# Altium schematic sheet eos26_motherboard_heater_adapter_banana.SchDoc
size A
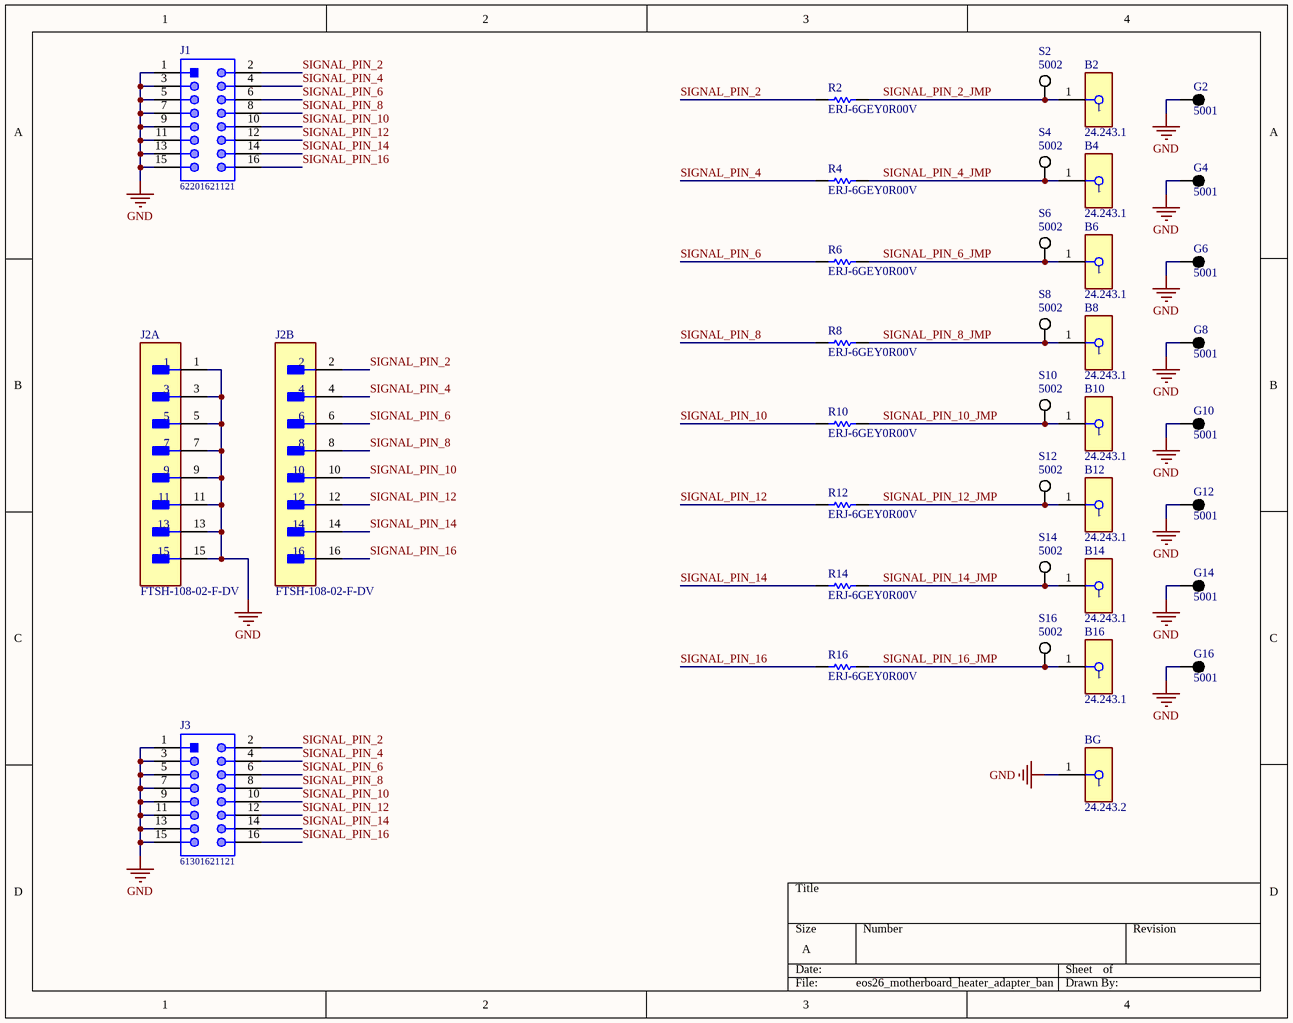
[diagram p0: eos26_motherboard_heater_adapter_banana.SchDoc]

## Parts
B2  24.243.1  [FP-24_243_1-MFG]
B4  24.243.1  [FP-24_243_1-MFG]
B6  24.243.1  [FP-24_243_1-MFG]
B8  24.243.1  [FP-24_243_1-MFG]
B10  24.243.1  [FP-24_243_1-MFG]
B12  24.243.1  [FP-24_243_1-MFG]
B14  24.243.1  [FP-24_243_1-MFG]
B16  24.243.1  [FP-24_243_1-MFG]
BG  24.243.2  [FP-24_243_2-MFG]
G2  5001  [KSTN-5001]
G4  5001  [KSTN-5001]
G6  5001  [KSTN-5001]
G8  5001  [KSTN-5001]
G10  5001  [KSTN-5001]
G12  5001  [KSTN-5001]
G14  5001  [KSTN-5001]
G16  5001  [KSTN-5001]
J1  62201621121  [62201621121]
J2  FTSH-108-02-F-DV  [LIBRARYSOURCE=Vault|VAULTGUID=B7D15EC3-160A-466F-A46C-7801FE6295A7|REVISIONGUID=4386816A-B426-492F-A73C-09950B70C106|FOOTPRINT=FP-FTSH-108-02-F-DV]  (parts A,B of 2)
J3  61301621121  [61301621121]
R2  ERJ-6GEY0R00V  [RESC2013X70X40NL20T20]
R4  ERJ-6GEY0R00V  [RESC2013X70X40NL20T20]
R6  ERJ-6GEY0R00V  [RESC2013X70X40NL20T20]
R8  ERJ-6GEY0R00V  [RESC2013X70X40NL20T20]
R10  ERJ-6GEY0R00V  [RESC2013X70X40NL20T20]
R12  ERJ-6GEY0R00V  [RESC2013X70X40NL20T20]
R14  ERJ-6GEY0R00V  [RESC2013X70X40NL20T20]
R16  ERJ-6GEY0R00V  [RESC2013X70X40NL20T20]
S2  5002  [KSTN-5002]
S4  5002  [KSTN-5002]
S6  5002  [KSTN-5002]
S8  5002  [KSTN-5002]
S10  5002  [KSTN-5002]
S12  5002  [KSTN-5002]
S14  5002  [KSTN-5002]
S16  5002  [KSTN-5002]

## Nets
GND: BG.1 G2.1 G4.1 G6.1 G8.1 G10.1 G12.1 G14.1 G16.1 J1.1 J1.3 J1.5 J1.7 J1.9 J1.11 J1.13 J1.15 J2.1 J2.3 J2.5 J2.7 J2.9 J2.11 J2.13 J2.15 J3.1 J3.3 J3.5 J3.7 J3.9 J3.11 J3.13 J3.15
SIGNAL_PIN_2: J1.2 J2.2 J3.2 R2.1
SIGNAL_PIN_2_JMP: B2.1 R2.2 S2.1
SIGNAL_PIN_4: J1.4 J2.4 J3.4 R4.1
SIGNAL_PIN_4_JMP: B4.1 R4.2 S4.1
SIGNAL_PIN_6: J1.6 J2.6 J3.6 R6.1
SIGNAL_PIN_6_JMP: B6.1 R6.2 S6.1
SIGNAL_PIN_8: J1.8 J2.8 J3.8 R8.1
SIGNAL_PIN_8_JMP: B8.1 R8.2 S8.1
SIGNAL_PIN_10: J1.10 J2.10 J3.10 R10.1
SIGNAL_PIN_10_JMP: B10.1 R10.2 S10.1
SIGNAL_PIN_12: J1.12 J2.12 J3.12 R12.1
SIGNAL_PIN_12_JMP: B12.1 R12.2 S12.1
SIGNAL_PIN_14: J1.14 J2.14 J3.14 R14.1
SIGNAL_PIN_14_JMP: B14.1 R14.2 S14.1
SIGNAL_PIN_16: J1.16 J2.16 J3.16 R16.1
SIGNAL_PIN_16_JMP: B16.1 R16.2 S16.1

## Library data of the parts
B2 B4 B6 B8 B10 B12 B14 B16 = CMP-12400-000001-1: RECEPTACLE, 20A, 4MM, PCB, SOLDER, RED; Manufacturer: Multicomp; Conn Orientation: Horizontal; Number Of Contacts: 1; Current Rating: 24A; Voltage Rating: 60V; Is Female: yes; ComponentLink2Description: Datasheet; Device Class L3: unset; Manufacturer Part Number: 24.243.1; RoHS: TRUE; Package: 24.243.1; ComponentLink2URL: https://datasheet.octopart.com/24.243.1-Multicomp-datasheet-38887736.pdf; Lead Free: Yes; Category: Conn; Height: 13mm; Device Class L2: unset; Device Class L1: Connectors; Contact Material: Silver; Automotive: No; Octopart: https://octopart.com/24.243.1-multicomp-57101049
BG = CMP-12400-000002-1: RECEPTACLE, 20A, 4MM, PCB, SOLDER, BLACK; Manufacturer: Multicomp; Is Female: yes; Current Rating: 24A; Number Of Contacts: 1; Conn Orientation: Horizontal; Voltage Rating: 60V; Device Class L3: unset; Category: Conn; Contact Material: Silver; Octopart: https://octopart.com/24.243.2-multicomp-57101050; ComponentLink2URL: https://datasheet.octopart.com/24.243.2-Multicomp-datasheet-38887736.pdf; ComponentLink2Description: Datasheet; Automotive: No; Package: 24.243.2; Height: 13mm; Device Class L2: unset; Device Class L1: Connectors; Lead Free: Yes; Manufacturer Part Number: 24.243.2; RoHS: TRUE
G2 G4 G6 G8 G10 G12 G14 G16 = CMP-2000-05181-1: Test Point, Black, 1-Pin THD, RoHS, Bulk; Manufacturer: Keystone; Other Names: 5001K; Catalog Drawings: 5000Series; Alternate Color: 5004K-ND / -TESTPOINTPCMINI.040"DYELLOW / 5003K-ND / -TESTPOINTPCMINI.040"DORANGE / 5002K-ND / -TESTPOINTPCMINI.040"DWHITE / 5000K-ND / -TESTPOINTPCMINI.040"DRED; Kits: DKTGRS232C-KIT-ND / -TTLCONVERTER; Online Catalog: ColorCodedTestPoints; Datasheet URL: https://ciiva.com/datasheet-click-2917627?src=ciiva&sig=bd195616; Mounting Type: 0.040"(1.02mm)HoleDiameter; Family: TestPoints; RoHS Information: RoHSComplianceStatement; Datasheet Version: Rev. G, 12/2008; Color: Black; Category: TestandMeasurement; Standard Package: 100; Manufacturer URL: http://www.keyelco.com/; Material: Base,Nylon46,UL94V-0; Type: PCTestPoint,Miniature; Terminal: 0.010"x0.020"(0.25mmx0.51mm)PhosphorBronzeWire,SilverPlated; Series: THM; Packaging: Bulk
J1 = CMP-1502-00950-1: THT Vertical Pin Header WR-PHD, Pitch 1.27 mm, Dual Row, 16 pins; Manufacturer: Wurth Elektronik; Gender: Male; Working Voltage: 100VAC; Rated Current: 1A; Pin Number: 16; Pitch: 1.27mm; Contact Resistance: 20mOhm; Withstanding Voltage: 500VAC; Publisher: WurthElektronik; Package Reference: 62201621121; Part Number: 62201621121; Packaging: Box; Row Number: Dual; Mounting Technology: THT; Operating Temperature: -40to105degC; Manufacturer URL: http://www.we-online.de; Orientation: Vertical; Datasheet URL: https://katalog.we-online.de/em/datasheet/62201621121.pdf
J2 = FP-FTSH-108-02-F-DV: CONN HEADER SMD 16POS 1.27MM; Manufacturer: Samtec; Standoff Height: 0.46mm; Conn Orientation: Vertical; Current Rating: 3.4A; Number Of Contacts: 16; Conn Gender: Male; Lead Free: Yes; Package: FTSH-108-02-F-DV; Footprint Url: http://suddendocs.samtec.com/prints/ftsh-1xx-xx-xxx-dv-xxx-footprint.pdf; Automotive: No; Pitch: 1.27mm; Manufacturer Part Number: FTSH-108-02-F-DV; Device Class L2: Headers and Wire Housings; ComponentLink2URL: http://suddendocs.samtec.com/prints/ftsh-1xx-xx-xxx-dv-xxx-xxx-mkt.pdf; ComponentLink2Description: Datasheet; Octopart: https://octopart.com/ftsh-108-02-f-dv-samtec-10605893; RoHS: TRUE; Digikey Description: CONN HEADER SMD 16POS 1.27MM; Device Class L1: Connectors; Temperature Range High: +125°C; Temperature: -55°C to +125°C; Device Class L3: unset; Category: Conn; Temperature Range Low: -55°C; Number Of Rows: 2; Contact Material: Gold,Nickel; Mouser Description: Conn Unshrouded Header HDR 16 POS 1.27mm Solder ST SMD Tube; Height: 5.09mm
J3 = CMP-1502-01097-1: THT Vertical Pin Header WR-PHD, Pitch 2.54 mm, Dual Row, 16 pins; Manufacturer: Wurth Elektronik; Gender: Male; Rated Current: 3A; Pitch: 2.54mm; Withstanding Voltage: 500VAC; Contact Resistance: 20mOhm; Working Voltage: 250VAC; Pin Number: 16; Mounting Technology: THT; Orientation: Vertical; Manufacturer URL: http://www.we-online.de; Row Number: Dual; Part Number: 61301621121; Datasheet URL: https://katalog.we-online.de/em/datasheet/6130xx21121.pdf; Packaging: Bag; Operating Temperature: -40to105degC; Publisher: WurthElektronik; Package Reference: 61301621121
R2 R4 R6 R8 R10 R12 R14 R16 = CMP-1665-00002-5: Chip Resistor, 0 Ohm, +/- 1%, 0.125 W, -55 to 155 degC, 0805 (2012 Metric), RoHS, Tape and Reel; Tolerance: 5%; Resistance: 0 Ohm; REACH SVHC: No SVHC; Min Operating Temperature: -55 degC; Case/Package: 0805; Packaging: Tape and Reel; Package Quantity: 5000; ComponentLink1Description: Manufacturer URL; PackageDescription: 2-Pin Surface Mount Device, Body 2 x 1.25 mm; Mounting Technology: Surface Mount; Max Operating Temperature: 155 degC; PartNumber: ERJ-6GEY0R00V; Width: 1.25 mm; RoHSCompliant: True; Height: 0.6 mm; ComponentLink1URL: http://www.panasonic.com/; ComponentLink2URL: http://industrial.panasonic.com/cdbs/www-data/pdf/RDA0000/AOA0000C84.pdf; Case Code (Imperial): 0805; DatasheetVersion: 03/2015; Length: 2 mm; Case Code (Metric): 2012; ComponentLink2Description: Datasheet; Radiation Hardening: No
S2 S4 S6 S8 S10 S12 S14 S16 = CMP-2000-05182-1: Test Point, White, 1-Pin THD, RoHS, Bulk; Manufacturer: KeystoneElectronics; Outside Diameter: 2.54mm; Plating: Silver; Mounting Hole Size: 1mm; Product: TestPoints; Packaging: Bulk; Manufacturer URL: http://www.keyelco.com/; Length: 7.62mm; Datasheet Version: Rev. G, 12/2008; Type: Miniature; Product Category: CircuitBoardHardware-PCB; Material: Nylon; RoHS: True; Contact Material: PhosphorBronze; Datasheet URL: https://ciiva.com/datasheet-click-2917627?src=ciiva&sig=bd195616; Color: White; Brand: KeystoneElectronics